# EAGLE design touchPadShield_n0m1 0v09 (EAGLE 5.10)
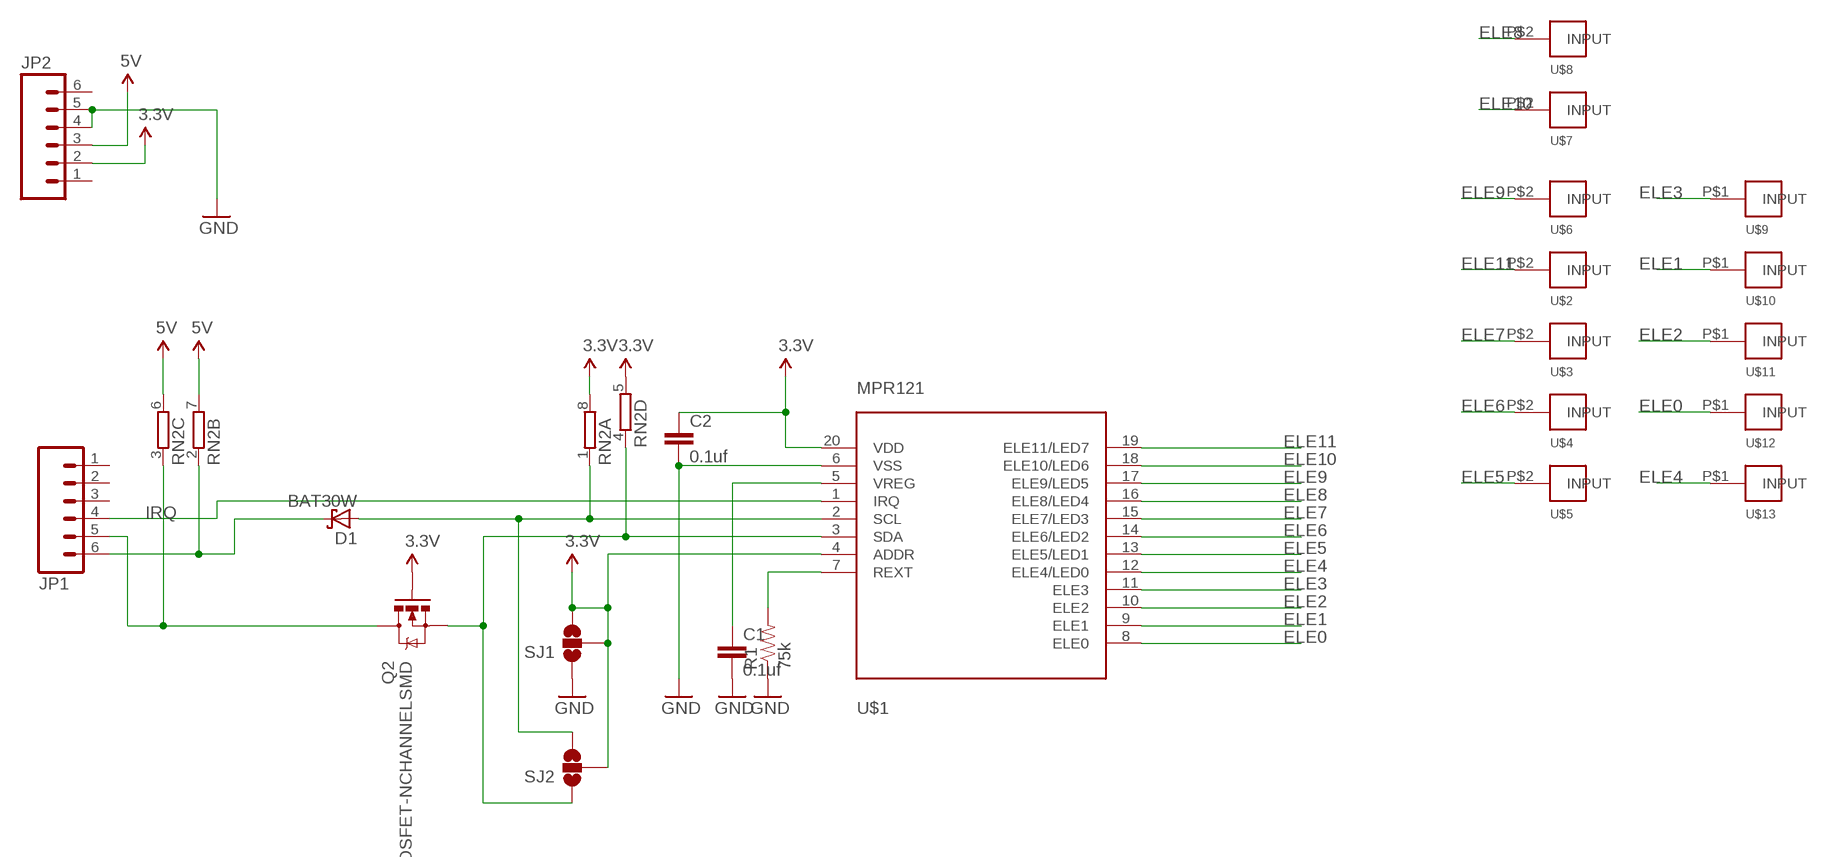
[diagram p0: schematic, sheet 1]

## Parts
C1  0.1uf  CAP0603-CAP  [0603-CAP]
C2  0.1uf  CAP0603-CAP  [0603-CAP]
D1  BAT30W  [SOT323]
JP1  M06SMD-STRAIGHT-COMBO  [1X06_SMD_STRAIGHT_COMBO]
JP2  M06SMD-STRAIGHT-COMBO  [1X06_SMD_STRAIGHT_COMBO]
Q2  MOSFET-NCHANNELSMD  [SOT23-3]
R1  75k  RESISTOR0603-RES  [0603-RES]
RN2  4R-NEXBV8V  [EXBV8V]
SJ1  SOLDERJUMPER_2WAYS  [SJ_3]
SJ2  SOLDERJUMPER_2WAYS  [SJ_3]
U$1  MPR121  [QFN-20]
U$2  TOUCHPAD_ELECTRODE_ROW  TOUCHPAD_ELECTRODE_ROWTOP_EDGE_12MM  [ELECTRODE_PAD_ROW_TOP_EDGE_12MM]
U$3  TOUCHPAD_ELECTRODE_ROW  TOUCHPAD_ELECTRODE_ROWTOP_12MM  [ELECTRODE_PAD_ROW_TOP_12MM]
U$4  TOUCHPAD_ELECTRODE_ROW  TOUCHPAD_ELECTRODE_ROWTOP_12MM  [ELECTRODE_PAD_ROW_TOP_12MM]
U$5  TOUCHPAD_ELECTRODE_ROW  TOUCHPAD_ELECTRODE_ROWTOP_12MM  [ELECTRODE_PAD_ROW_TOP_12MM]
U$6  TOUCHPAD_ELECTRODE_ROW  TOUCHPAD_ELECTRODE_ROWTOP_12MM  [ELECTRODE_PAD_ROW_TOP_12MM]
U$7  TOUCHPAD_ELECTRODE_ROW  TOUCHPAD_ELECTRODE_ROWTOP_12MM  [ELECTRODE_PAD_ROW_TOP_12MM]
U$8  TOUCHPAD_ELECTRODE_ROW  TOUCHPAD_ELECTRODE_ROWTOP_12MM  [ELECTRODE_PAD_ROW_TOP_12MM]
U$9  TOUCHPAD_ELECTRODE_ROWBOTTOM_12MM  [ELECTRODE_PAD_ROW_BOTTOM_12MM]
U$10  TOUCHPAD_ELECTRODE_ROWBOTTOM_12MM  [ELECTRODE_PAD_ROW_BOTTOM_12MM]
U$11  TOUCHPAD_ELECTRODE_ROWBOTTOM_12MM  [ELECTRODE_PAD_ROW_BOTTOM_12MM]
U$12  TOUCHPAD_ELECTRODE_ROWBOTTOM_EDGE_12MM  [ELECTRODE_PAD_ROW_BOTTOM_EDGE_12MM]
U$13  TOUCHPAD_ELECTRODE_ROWBOTTOM_12MM  [ELECTRODE_PAD_ROW_BOTTOM_12MM]

## Nets
3.3V: C2.1 JP2.2 Q2.1(G) RN2.5 RN2.8 SJ1.2 SJ1.3 SJ2.2 U$1.4(ADDR) U$1.20(VDD)
5V: JP2.3 RN2.6 RN2.7
ELE0: U$1.8(ELE0) U$12.P$1(INPUT)
ELE1: U$1.9(ELE1) U$10.P$1(INPUT)
ELE2: U$1.10(ELE2) U$11.P$1(INPUT)
ELE3: U$1.11(ELE3) U$9.P$1(INPUT)
ELE4: U$1.12(ELE4/LED0) U$13.P$1(INPUT)
ELE5: U$1.13(ELE5/LED1) U$5.P$2(INPUT)
ELE6: U$1.14(ELE6/LED2) U$4.P$2(INPUT)
ELE7: U$1.15(ELE7/LED3) U$3.P$2(INPUT)
ELE8: U$1.16(ELE8/LED4) U$8.P$2(INPUT)
ELE9: U$1.17(ELE9/LED5) U$6.P$2(INPUT)
ELE10: U$1.18(ELE10/LED6) U$7.P$2(INPUT)
ELE11: U$1.19(ELE11/LED7) U$2.P$2(INPUT)
GND: C1.2 C2.2 JP2.4 JP2.5 R1.1 SJ1.1 U$1.6(VSS)
IRQ: JP1.4 U$1.1(IRQ)
N$1: C1.1 U$1.5(VREG)
N$2: R1.2 U$1.7(REXT)
N$18: JP1.5 Q2.3(D) RN2.3
N$19: D1.3(C) JP1.6 RN2.2
SCL: D1.1(A) RN2.1 SJ2.3 U$1.2(SCL)
SDA: Q2.2(S) RN2.4 SJ2.1 U$1.3(SDA)
Unconnected: JP1.1 JP1.2 JP1.3 JP2.1 JP2.6

## Library data of the parts
C1 C2 = SparkFun:CAP: Capacitor Standard 0603 ceramic capacitor, and 0.1" leaded capacitor.
D1 = nomiDesign:BAT30W
JP1 JP2 = SparkFun:M06: Header 6 Standard 6-pin 0.1" header. Use with straight break away headers (SKU : PRT-00116), right angle break away headers (PRT-00553), swiss pins (PRT-00743), machine pins (PRT-00117), and female headers (PRT-00115). Molex polarized connector foot print use with SKU : PRT-08094 with associated crimp pins and housings. NOTES ON THE VARIANTS LOCK and LOCK_LONGPADS... This footprint was designed to help hold the alignment of a through-hole component (i.e. 6-pin header) while soldering it into place. You may notice that each hole has been shifted either up or down by 0.005 of an inch from it's more standard position (which is a perfectly straight line). This slight alteration caused the pins (the squares in the middle) to touch the edges of the holes. Because they are alternating, it causes a "brace" to hold the component in place. 0.005 has proven to be the perfect amount of "off-center" position when using our standard breakaway headers. Although looks a little odd when you look at the bare footprint, once you have a header in there, the alteration is very hard to notice. Also, if you push a header all the way into place, it is covered up entirely on the bottom side. This idea of altering the position of holes to aid alignment will be further integrated into the Sparkfun Library for other footprints. It can help hold any component with 3 or more connection pins.
Q2 = SparkFun:MOSFET-NCHANNEL
R1 = SparkFun:RESISTOR: Resistor Basic schematic elements and footprints for 0603, 1206, and PTH resistors.
RN2 = resistor-dil:4R-N: Array Chip Resistor Source: RS Component / Phycomp
SJ1 SJ2 = SparkFun:SOLDERJUMPER_2WAY: Solder Jumper 2 way solder jumper
U$1 = nomiDesign:MPR121: The MPR121 features increased internal intelligence, some of the major additions include an increased electrode count, a hardware configurable I2C address, an expanded filtering system with debounce, and completely independent electrodes with auto-configuration built in. The device also features a 13th simulated sensing channel dedicated for near proximity detection using the multiplexed sensing inputs.
U$2-U$13 = nomiDesign:TOUCHPAD_ELECTRODE_ROW: A series of electrode pads, for creating the rows and columns of a touch pad

## Board
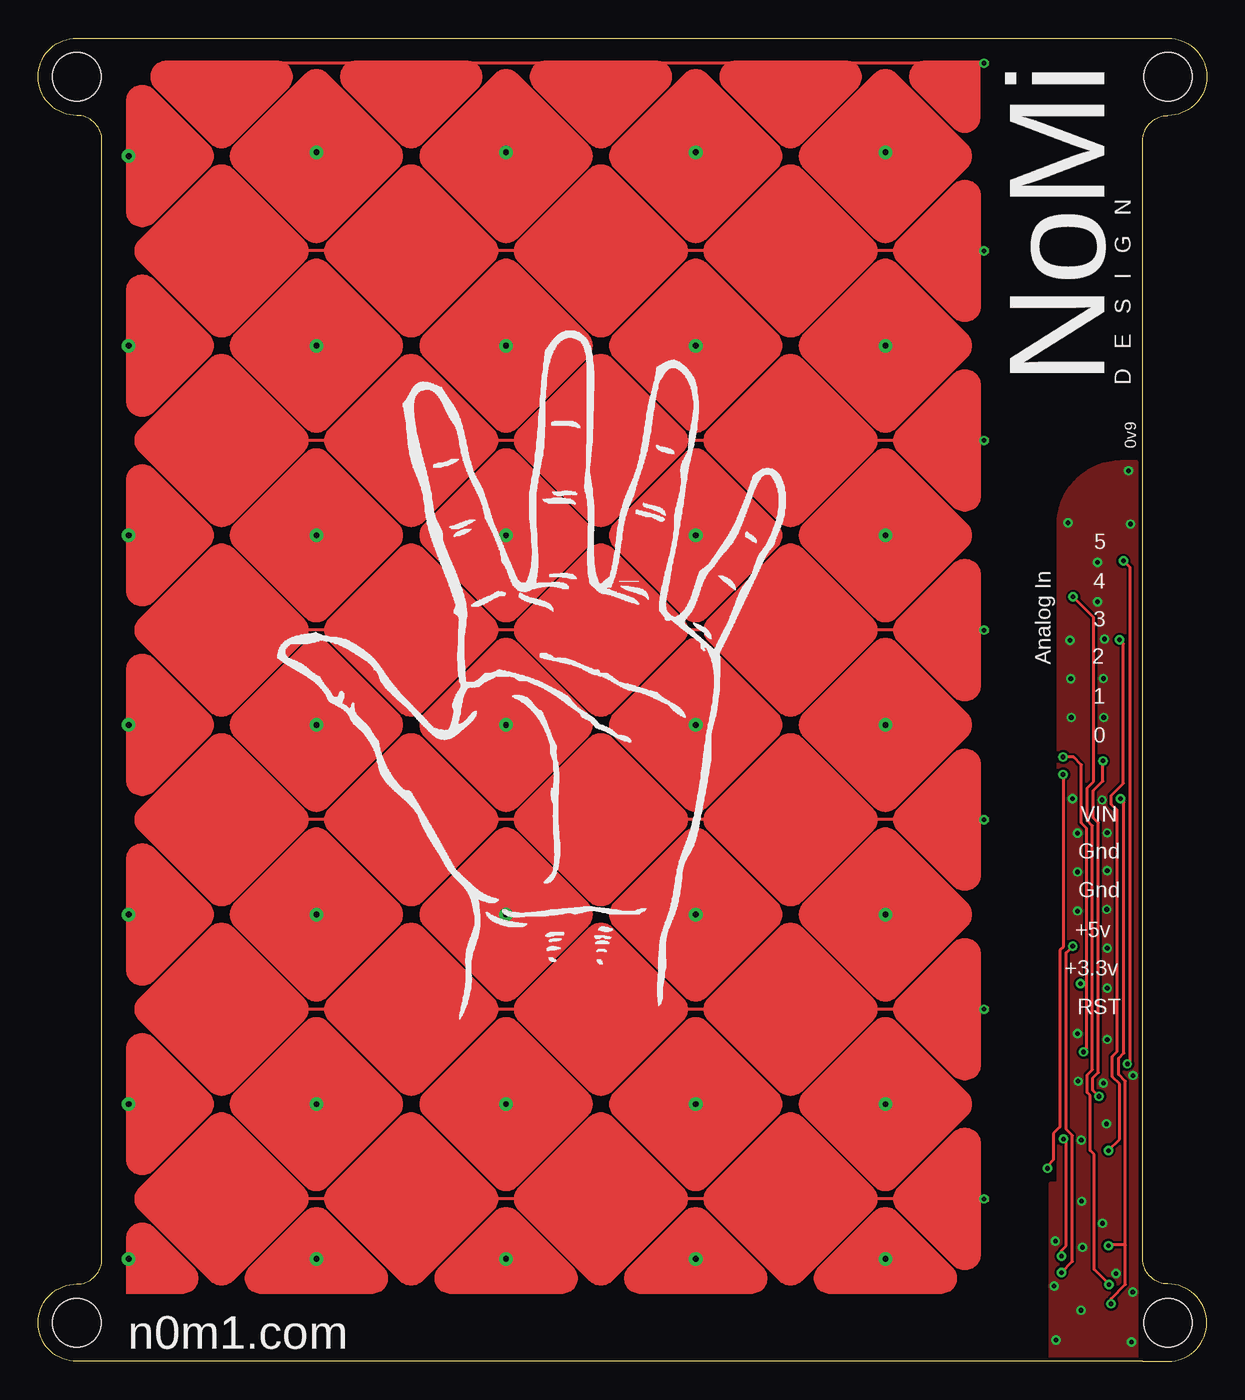
[diagram p1: board, top side]
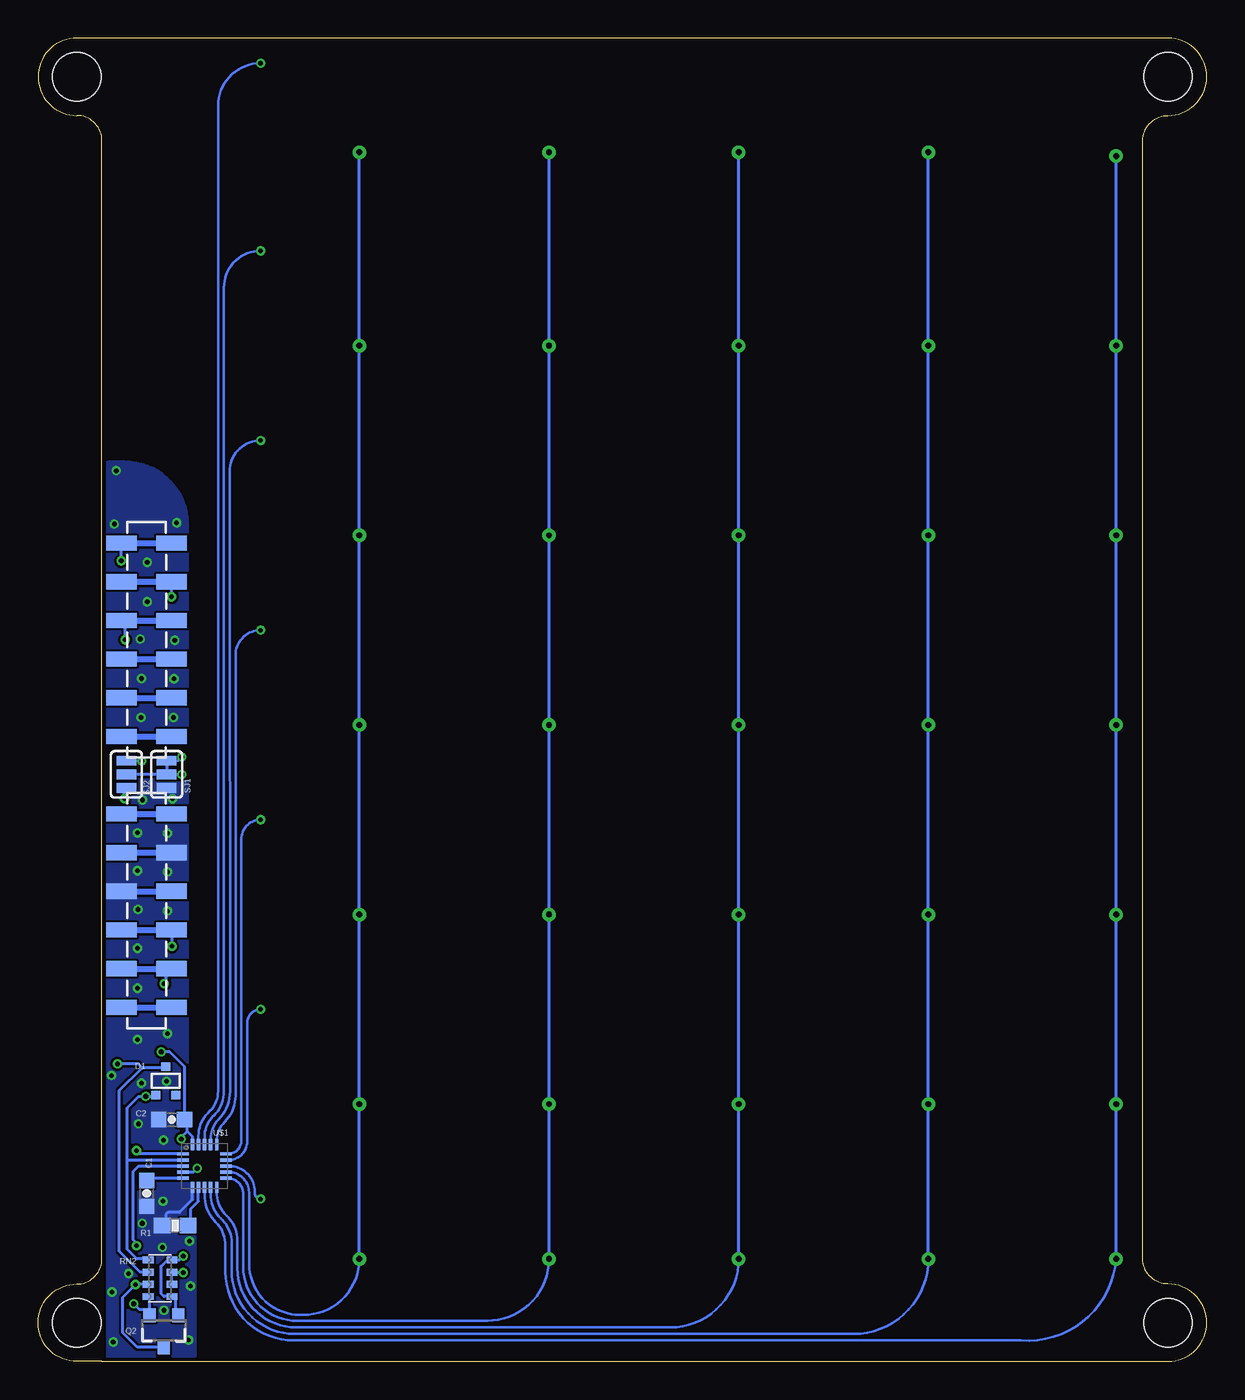
[diagram p2: board, bottom side, seen from below]

Size 76.68 x 86.87 mm. Coordinates in mm from the lower left corner, seen from the top.
Outline: 72.49,0 2.54,0 arc-90 0,2.54 arc-90 2.54,5.08 arc90 4.19,6.73 4.19,80.14 arc90 2.54,81.79 arc-90 0,84.33 arc-90 2.54,86.87 74.14,86.87 arc-90 76.68,84.33 arc-90 74.14,81.79 arc90 72.49,80.14 72.49,6.73 arc90 74.14,5.08 arc-90 76.68,2.54 arc-90 74.14,0 72.49,0
Copper layers (1*16): Top 0.035mm / dielectric 1.5mm / Bottom 0.035mm
Design rules "Fusion_eagle_rule_v1.1": minimum track width 6mil, minimum drill 12mil, track to track 6mil, track to pad 6mil, pad to pad 6mil, via to via 6mil, smd to smd 0mil, copper to edge 10mil, drill to drill 10mil, minimum pad ring 10mil, minimum via ring 6mil, stop-mask expansion 2mil, vias tented up to drill 100mil, thermal gap 10mil
Holes 3.17 mm at 2.54,2.54 2.54,84.33 74.14,84.33 74.14,2.54

### Footprints (pad centres in the part's own frame; a part is rotated, then mirrored left to right if it is on the bottom)
0603-CAP = smd 1 x 1: 1 -0.85,0; 2 0.85,0
SOT323 = smd 0.6 x 0.55: 1 -0.65,-0.925; 2 0.65,-0.925; 3 0,0.925
1X06_SMD_STRAIGHT_COMBO = smd 1 x 2: 1 0,-1.65; 1-2 0,1.65; 2 2.54,1.65; 2-2 2.54,-1.65; 3 5.08,-1.65; 3-2 5.08,1.65; 4 7.62,1.65; 4-2 7.62,-1.65; 5 10.16,-1.65; 5-2 10.16,1.65; 6 12.7,1.65; 6-2 12.7,-1.65
SOT23-3 = smd 0.8 x 0.9: 1 -0.95,-1; 2 0.95,-1; 3 0,1.1
0603-RES = smd 1.1 x 1: 1 -0.85,0; 2 0.85,0
EXBV8V = smd 0.45 x 0.7: 1 -1.2,-0.775; 2 -0.4,-0.775; 3 0.4,-0.775; 4 1.2,-0.775; 5 1.2,0.775; 6 0.4,0.775; 7 -0.4,0.775; 8 -1.2,0.775
SJ_3 = smd 0.635 x 1.27: 1 -0.889,0; 2 0,0; 3 0.889,0
QFN-20 = smd 0.75 x 0.22: 1 -1.4,0.8; 2 -1.4,0.4; 3 -1.4,0; 4 -1.4,-0.4; 5 -1.4,-0.8; 11 1.4,-0.8; 12 1.4,-0.4; 13 1.4,0; 14 1.4,0.4; 15 1.4,0.8 | smd 0.22 x 0.75: 6 -0.8,-1.4; 7 -0.4,-1.4; 8 0,-1.4; 9 0.4,-1.4; 10 0.8,-1.4; 16 0.8,1.4; 17 0.4,1.4; 18 0,1.4; 19 -0.4,1.4; 20 -0.8,1.4
ELECTRODE_PAD_ROW_TOP_EDGE_12MM = smd 0.279 x 0.61: P$2 0.127,0.254
ELECTRODE_PAD_ROW_TOP_12MM = smd 0.305 x 0.61: P$2 0,0.254
ELECTRODE_PAD_ROW_BOTTOM_12MM = drill 0.381 pad 0.762 round: P$1 0,-2.286; P$3 0,-12.446; P$4 0,-24.892; P$5 0,-37.338; P$6 0,-49.784; P$7 0,-62.23; P$8 0,-74.93
ELECTRODE_PAD_ROW_BOTTOM_EDGE_12MM = drill 0.381 pad 0.762 round: P$1 -0.127,-2.286; P$3 -0.127,-12.446; P$4 -0.127,-24.892; P$5 -0.127,-37.338; P$6 -0.127,-49.784; P$7 -0.127,-62.23; P$8 -0.127,-74.676

### Placement (x,y rotation side)
C1  69.55,11.02 270 bottom
C2  67.92,15.88 180 bottom
D1  68.3,18.41 0 bottom
JP1  69.57,41.02 90 bottom
JP2  69.57,23.24 90 bottom
Q2  68.43,2.03 180 bottom
R1  67.69,8.92 0 bottom
RN2  68.68,5.46 270 bottom
SJ1  68.25,38.53 90 bottom
SJ2  70.89,38.53 90 bottom
U$1  65.76,12.83 0 bottom
U$2  61.82,85.34 270 top
U$3  61.82,35.56 270 top
U$4  61.82,23.11 270 top
U$5  61.82,10.67 270 top
U$6  61.82,60.45 270 top
U$7  61.82,72.9 270 top
U$8  61.82,48.01 270 top
U$9  43.15,4.45 180 top
U$10  18.26,4.45 180 top
U$11  30.71,4.45 180 top
U$12  5.82,4.45 180 top
U$13  55.6,4.45 180 top

### Tracks (layer width: path | path; a pad name or v marks a point on that pad's centre or on a via)
3.3V  (via drill 0.3)
  Top 0.203: v67.26,39.67 67.94,39.67 68.45,39.17 68.45,35.36 68.81,35 68.81,24.79 | 68.81,24.79 68.81,20.52 v68.61,20.32 | 68.81,24.79 v68.4,24.79 | v67.28,14.61 67.46,14.43 67.46,7.59 67.16,7.29 v67.16,6.91 | v66.24,12.68 66.24,12.85 66.62,13.23 66.62,14.96 67.06,15.39 67.06,27 67.26,27.2 v67.26,38.53
  Bottom 0.203: U$1.20 66.56,14.77 66.9,15.11 | 66.9,15.11 66.9,15.71 C2.1 67.07,19.34 68.05,20.32 v68.61,20.32 | 67.54,3.09 Q2.1 67.5,3.03 67.67,3.2 67.67,4.02 RN2.5 68.42,4.26 68.61,4.45 68.61,6.25 68.25,6.6 67.96,6.6 RN2.8 67.41,6.66 v67.16,6.91 | v67.28,14.61 67.28,14.73 66.9,15.11 | JP2.2 68.4,25.78 68.28,25.65 68.28,24.94 v68.4,24.79 | v67.26,39.67 67.51,39.42 SJ1.3 SJ1.2 | U$1.4 66.49,12.43 v66.24,12.68 | 70.76,38.41 SJ2.2 SJ1.2 | SJ1.2 v67.26,38.53
5V  (via drill 0.3)
  Top 0.203: v67.16,5.84 67.87,6.56 67.87,14.83 67.46,15.24 67.46,26.82 v67.89,27.25
  Bottom 0.203: RN2.6 RN2.7 67.89,5.84 v67.16,5.84 | 67.74,28.14 JP2.3 | 67.74,28.14 67.54,27.94 | 67.74,28.14 67.89,28.14 v67.89,27.25
ELE0
  Bottom 0.152: U$12.P$1 arc90 12.19,1.37 59.89,1.37 arc90 64.39,5.88 64.39,7.62 arc-45 65.02,9.13 arc45 65.76,10.94 U$1.8
ELE1
  Bottom 0.152: U$10.P$1 arc90 23.19,1.8 59.84,1.8 arc90 63.98,5.95 63.98,7.82 arc-45 64.58,9.26 64.7,9.38 arc45 65.36,10.97 U$1.9
ELE2
  Bottom 0.152: 64.96,11.12 arc-45 64.31,9.55 64.22,9.46 arc45 63.6,7.97 63.6,6.1 arc-90 59.74,2.23 35.2,2.23 arc-90 U$11.P$1
  Bottom 0.203: 64.96,11.12 U$1.10
ELE3
  Bottom 0.152: 64.25,12.03 arc90 63.22,10.99 63.22,6.22 arc-90 59.66,2.67 47.22,2.67 arc-90 U$9.P$1
  Bottom 0.203: 64.25,12.03 U$1.11
ELE4
  Bottom 0.152: 64.16,12.43 arc90 62.84,11.1 62.84,6.42 arc-90 59.46,3.05 59.28,3.05 arc-90 U$13.P$1
  Bottom 0.203: 64.16,12.43 U$1.12
ELE5  (via drill 0.3)
  Bottom 0.152: 64.14,12.83 arc90 62.46,11.14 62.46,11.05 arc-90 U$5.P$2
  Bottom 0.203: 64.14,12.83 U$1.13
  other vias: 62.08,10.67
ELE6  (via drill 0.3)
  Bottom 0.152: 64.17,13.23 arc-90 62.97,14.43 62.97,22.23 arc90 U$4.P$2
  Bottom 0.203: U$1.14 64.17,13.23
  other vias: 62.08,23.11
ELE7  (via drill 0.3)
  Bottom 0.152: 64.2,13.63 arc-90 63.35,14.48 63.35,34.29 arc90 U$3.P$2
  Bottom 0.203: U$1.15 64.2,13.63
  other vias: 62.08,35.56
ELE8  (via drill 0.3)
  Bottom 0.152: U$8.P$2 arc-90 63.73,46.35 63.73,17.43 arc45 64.43,15.73 64.44,15.72 arc-45 64.96,14.47
  Bottom 0.203: U$1.16 64.96,14.47
  other vias: 62.08,48.01
ELE9  (via drill 0.3)
  Bottom 0.152: U$6.P$2 arc-90 64.11,58.42 64.08,17.75 64.08,17.72 arc45 64.85,15.87 arc-45 65.36,14.64 U$1.17
  other vias: 62.08,60.45
ELE10  (via drill 0.3)
  Bottom 0.152: U$7.P$2 arc-90 64.49,70.48 64.49,17.73 arc45 65.16,16.12 65.21,16.07 arc-45 65.76,14.74 U$1.18
  other vias: 62.08,72.9
ELE11  (via drill 0.3)
  Bottom 0.152: U$2.P$2 arc-90 64.87,82.42 64.87,17.72 arc45 65.4,16.43 65.54,16.3 arc-45 66.16,14.8 U$1.19
  Bottom 0.203: U$2.P$2 62.33,85.22
  other vias: 62.08,85.22
GND  (via drill 0.3)
  Bottom 0.203: U$1.6 66.56,10.63 67.41,9.78 68.17,9.78 68.3,9.65 68.3,8.98 R1.1
  other vias: 66.8,1.4 68.48,10.52 69.85,9.07 71.83,4.55 70.1,15.6 71.86,18.77 69.9,18.26 70.15,21.13 70.13,29.67 69.82,36.86 68.2,29.57 68.2,32.13 68.2,34.67 71.75,1.27 70.15,27.13 70.15,32.21 70.15,34.7 69.93,42.27 69.9,44.83 69.98,47.42 69.52,52.45 71.55,58.47 67.59,55.04 71.68,54.97 69.52,49.86 67.79,42.27 67.77,44.81 67.72,47.35 70.15,24.51 68.45,14.53 66.67,4.95 68.43,3.35 68.2,21.51 68.25,18.39 70.74,5.77 68.53,7.49 66.75,7.9 67.87,36.93
  pour Bottom (no thermals): 72.11,59.05 70.98,59.05 arc90 66.9,54.98 66.9,11.68 66.4,11.68 66.4,-0.89 72.11,-0.89
  pour Top (no thermals): 72.11,59.05 71.05,59.05 arc90 66.9,54.91 66.9,11.68 66.4,11.68 66.4,-0.89 72.11,-0.89
IRQ  (via drill 0.3)
  Top 0.203: v70.97,47.37 71.22,47.12 71.22,37.95 70.43,37.16 70.43,36.58 70.81,36.2 70.81,20.34 70.49,20.02 70.49,18.69 70.97,18.21 70.97,14.58 v70.23,13.84
  Bottom 0.203: v70.97,47.37 70.97,48.39 JP1.4 | v70.23,13.84 70.02,13.63 U$1.1
N$1
  Bottom 0.203: C1.1 69.37,12.03 U$1.5
N$2
  Bottom 0.203: U$1.7 66.16,10.52 66.65,10.03 66.65,8.93 R1.2
N$18  (via drill 0.3)
  Top 0.203: v67.92,50.19 69.27,48.84 69.27,38.08 68.83,37.64 68.83,35.51 69.19,35.15 69.19,19.15 68.83,18.8 68.83,17.65 69.04,17.45 69.04,13.84 69.29,13.59 69.29,6.04 v70.28,5.05
  Bottom 0.203: RN2.3 69.48,5.08 70.26,5.08 v70.28,5.05 71.12,4.22 71.12,1.88 70.17,0.93 Q2.3 68.56,1.06 | JP1.5 v67.92,50.19
N$19  (via drill 0.3)
  Top 0.203: v71.22,52.55 71.65,52.12 71.65,19.71 v71.48,19.53
  Bottom 0.203: RN2.2 69.97,5.86 71.35,7.24 71.35,17.78 69.85,19.28 | 69.85,19.28 69.83,19.3 68.34,19.3 D1.3 | JP1.6 v71.22,52.55 | v71.48,19.53 70.1,19.53 69.85,19.28
SCL  (via drill 0.3)
  Top 0.203: v69.88,39.42 69.88,38.1 69.24,37.47 69.24,35.69 69.57,35.36 69.57,18.97 69.22,18.62 69.22,17.8 v69.62,17.4
  Bottom 0.203: RN2.1 69.53,6.73 70.21,6.73 70.84,7.37 70.84,13.23 | D1.1 69.04,17.4 v69.62,17.4 70.08,17.4 70.84,16.64 70.84,13.23 | v69.88,39.42 SJ2.3 | U$1.2 70.83,13.23 70.84,13.23
SDA  (via drill 0.3)
  Top 0.203: v71.02,36.93 71.25,36.7 71.25,20.24 70.9,19.9 70.9,18.84 71.35,18.39 71.35,7.64 | v70.41,3.79 70.41,4.12 71.35,5.05 71.35,7.64 | v70.23,7.59 70.18,7.64 71.35,7.64
  Bottom 0.203: 69.39,4.19 RN2.4 69.38,4.18 69.38,3.4 | 69.38,3.4 Q2.2 | v71.02,36.93 71.02,37.52 SJ2.1 | v70.41,3.79 70.03,3.4 69.38,3.4 | U$1.3 70.09,12.83 70.43,12.49 70.43,7.98 70.13,7.67 v70.23,7.59

### Text on the board
tNames: NoMi | D E S I G N | 0v9 | 5 | 4 | 3 | Analog In | 2 | 1 | 0 | VIN | Gnd | Gnd | +5v | +3.3v | RST | n0m1.com